# EAGLE design power (EAGLE 6.5.1)
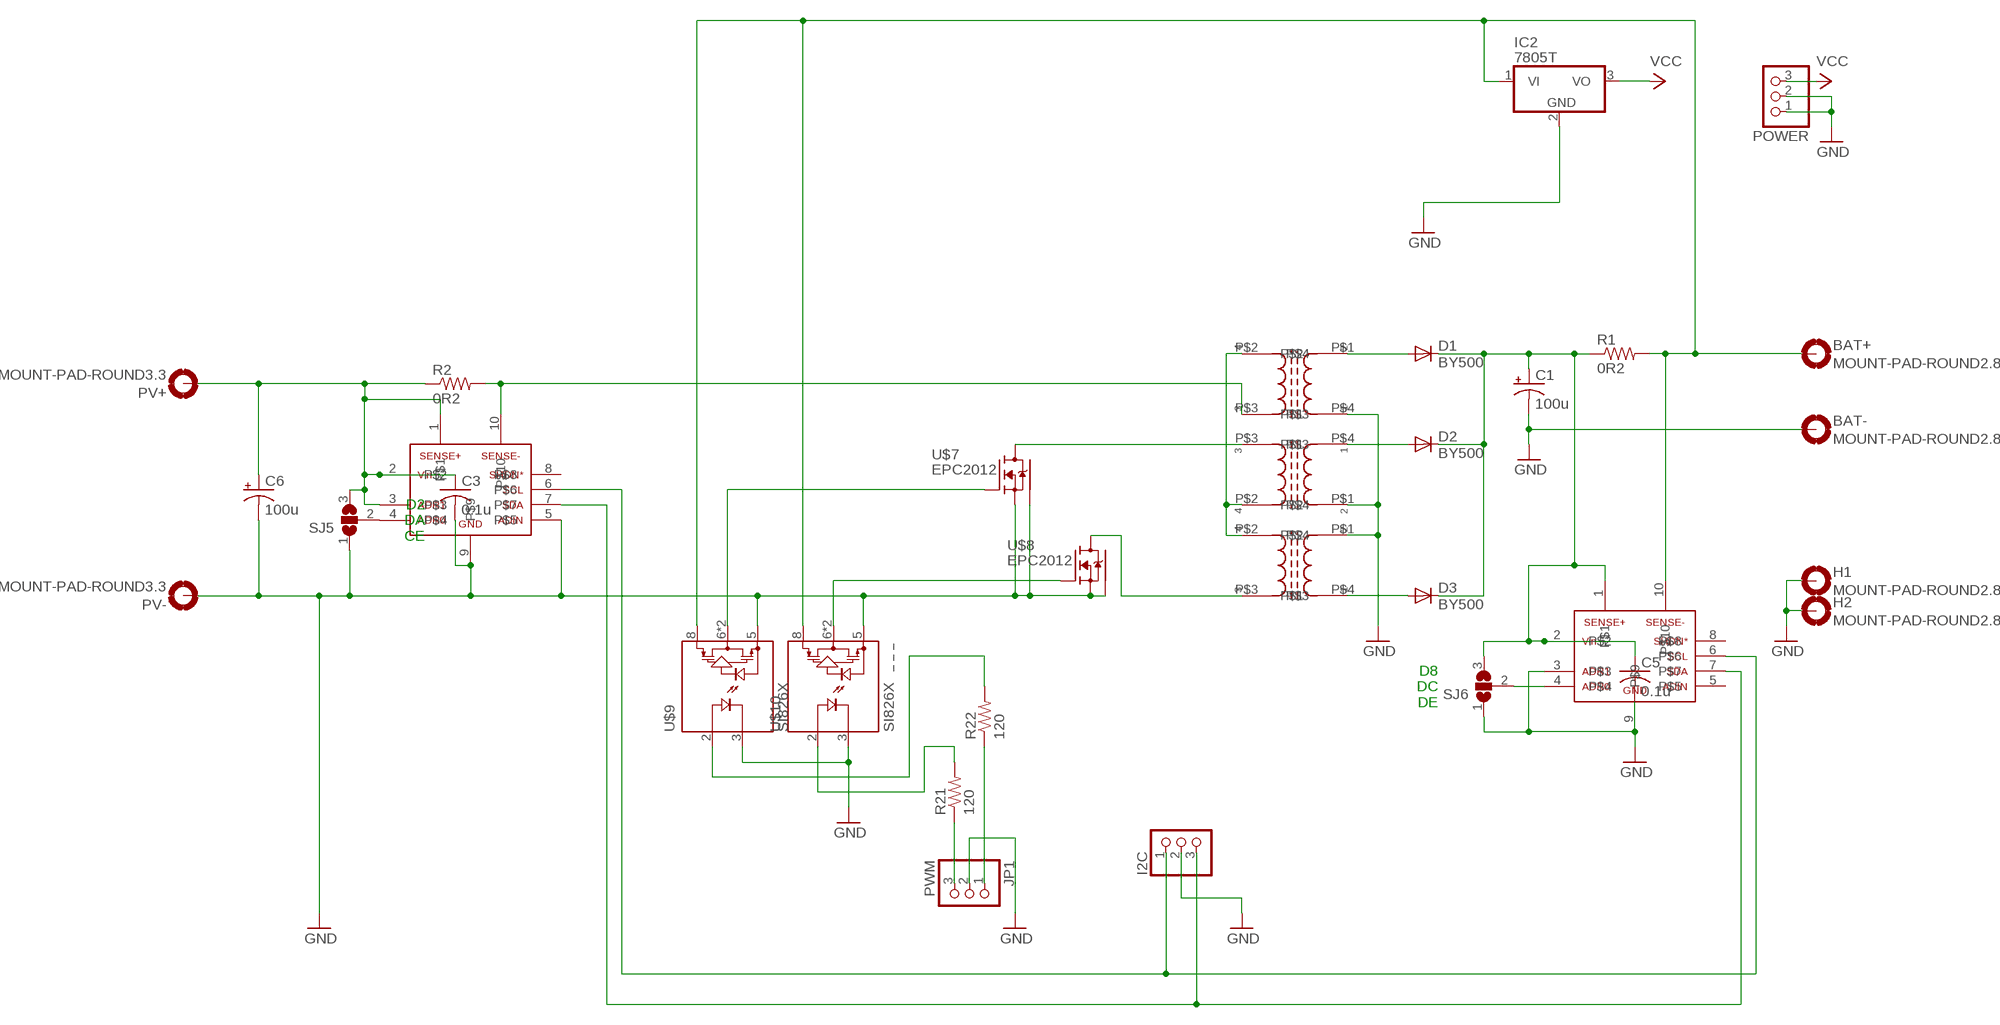
[diagram p0: schematic, sheet 1]

## Parts
BAT+  MOUNT-PAD-ROUND2.8  [2,8-PAD]
BAT-  MOUNT-PAD-ROUND2.8  [2,8-PAD]
C1  100u  CPOL-USE5-10.5  [E5-10,5]
C3  0.1u  C-USC0603K  [C0603K]
C5  0.1u  C-USC0603K  [C0603K]
C6  100u  CPOL-USE5-10.5  [E5-10,5]
D1  BY500  [DO201-15]
D2  BY500  [DO201-15]
D3  BY500  [DO201-15]
H1  MOUNT-PAD-ROUND2.8  [2,8-PAD]
H2  MOUNT-PAD-ROUND2.8  [2,8-PAD]
I2C  PINHD-1X3  [1X03]
IC2  7805T  [TO220H]
JP1  PWM  PINHD-1X3  [1X03]
POWER  PINHD-1X3  [1X03]
PV+  MOUNT-PAD-ROUND3.3  [3,3-PAD]
PV-  MOUNT-PAD-ROUND3.3  [3,3-PAD]
R1  0R2  R-US_R1206  [R1206]
R2  0R2  R-US_R1206  [R1206]
R21  120  R-US_R0603  [R0603]
R22  120  R-US_R0603  [R0603]
SJ5  SJ2W  [SJ_2]
SJ6  SJ2W  [SJ_2]
U$1  LTC4151  [MSOP10]
U$2  LTC4151  [MSOP10]
U$3  PLH10AN2211R5P2B  [L10-13]
U$4  TLF14CBH3321R0K1  [L13-17]
U$5  TLF14CBH3321R0K1  [L13-17]
U$7  EPC2012  [EGAN-DIE-7]
U$8  EPC2012  [EGAN-DIE-7]
U$9  SI826X  [SO08]
U$10  SI826X  [SO08]

## Nets
GND: BAT-.B2,8(MOUNT) C1.- C3.2 C5.2 C6.- H1.B2,8(MOUNT) H2.B2,8(MOUNT) I2C.2 IC2.2(GND) JP1.2 POWER.1 POWER.2 PV-.B3,3(MOUNT) SJ5.1 SJ6.1 U$1.5 U$1.9 U$2.3 U$2.9 U$3.P$4 U$4.P$1 U$5.P$1 U$7.SOURCE(S) U$7.SUBSTRATE U$8.SOURCE(S) U$8.SUBSTRATE U$9.3(GND1) U$9.5(GND2) U$10.3(GND1) U$10.5(GND2)
N$1 [power]: U$3.P$2 U$4.P$2 U$5.P$2
N$2: U$5.P$3 U$7.DRAIN(D)
N$3: U$4.P$3 U$8.DRAIN(D)
N$4: BAT+.B2,8(MOUNT) IC2.1(VI) R1.2 U$2.10 U$9.8(VDD2) U$10.8(VDD2)
N$5: D3.A U$4.P$4
N$7 [hi freq]: R21.2 U$10.2(VI)
N$9 [power]: D2.A U$5.P$4
N$10: SJ5.2 U$1.4
N$12 [power]: C1.+ C5.1 D1.C D2.C D3.C R1.1 SJ6.3 U$2.1 U$2.2
N$13 [hi freq]: U$8.GATE(G) U$10.6(VO) U$10.7(VO)
N$15 [power]: D1.A U$3.P$1
N$16 [hi freq]: U$7.GATE(G) U$9.6(VO) U$9.7(VO)
N$26: SJ6.2 U$2.4
N$27 [hi freq]: JP1.3 R21.1
N$37 [hi freq]: JP1.1 R22.1
N$44 [hi freq]: R22.2 U$9.2(VI)
PV: C3.1 C6.+ PV+.B3,3(MOUNT) R2.1 SJ5.3 U$1.1 U$1.2 U$1.3
PVIN [power]: R2.2 U$1.10 U$3.P$3
SCL: I2C.1 U$1.6 U$2.6
SDA: I2C.3 U$1.7 U$2.7
VCC: IC2.3(VO) POWER.3
Unconnected: U$1.8 U$2.5 U$2.8

## Notes on the sheet
- D2
  DA
  CE
- D8
  DC
  DE

## Library data of the parts
BAT+ BAT- H1 H2 PV+ PV- = holes:MOUNT-PAD-ROUND: MOUNTING PAD, round
C1 C6 = rcl:CPOL-US: POLARIZED CAPACITOR, American symbol
C3 C5 = rcl:C-US: CAPACITOR, American symbol
D1-D3 = diode:BY500: DIODE fast recovery diode, 5 A, 800 V
I2C JP1 POWER = pinhead:PINHD-1X3: PIN HEADER
IC2 = linear:78*: Positive VOLTAGE REGULATOR Source: http://cache.national.com/ds/LM/LM78L05.pdf http://www.fairchildsemi.com/ds/LM/LM7805.pdf
R1 R2 R21 R22 = rcl:R-US_: RESISTOR, American symbol
SJ5 SJ6 = jumper:SJ2W: SMD solder JUMPER
U$1 U$2 = semiconductors:LTC4151
U$3 = chokes:PLH10AN2211R5P2B
U$4 U$5 = chokes:TLF14CBH3321R0K1
U$7 U$8 = semiconductors:EPC2012
U$9 U$10 = semiconductors:SI826X

## Net classes
1 hi freq: width 0.203 mm, clearance 0.203 mm
2 power: width 0.61 mm, clearance 0.203 mm

## Board
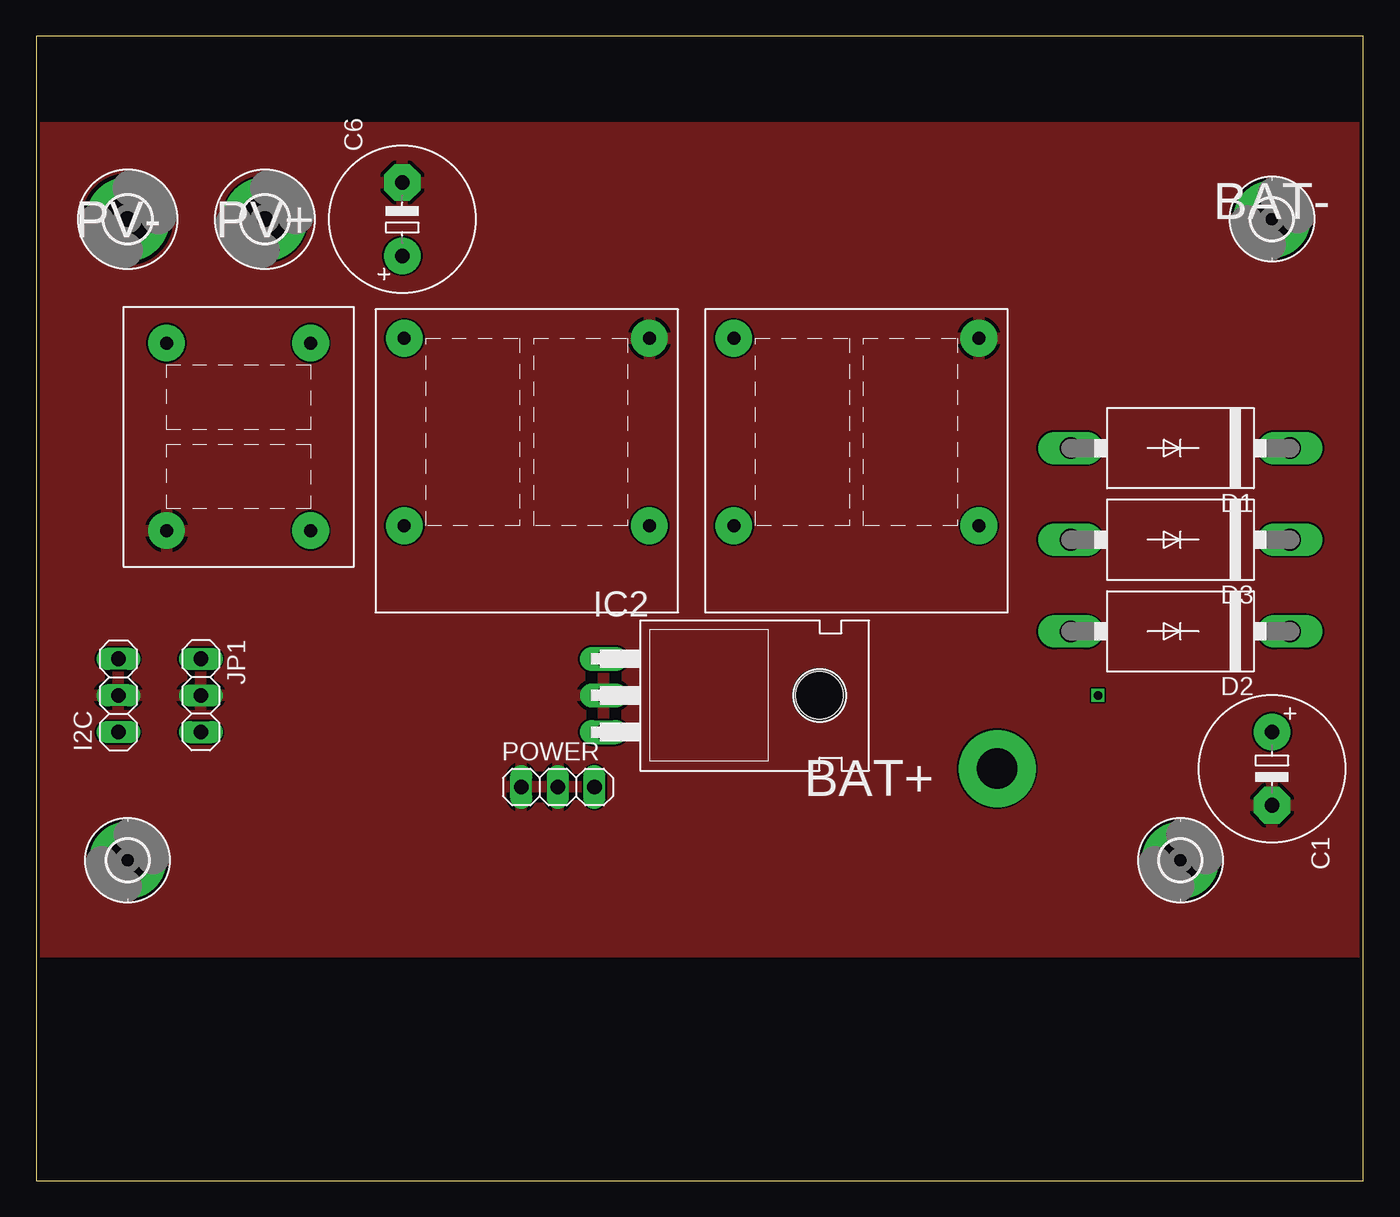
[diagram p1: board, top side]
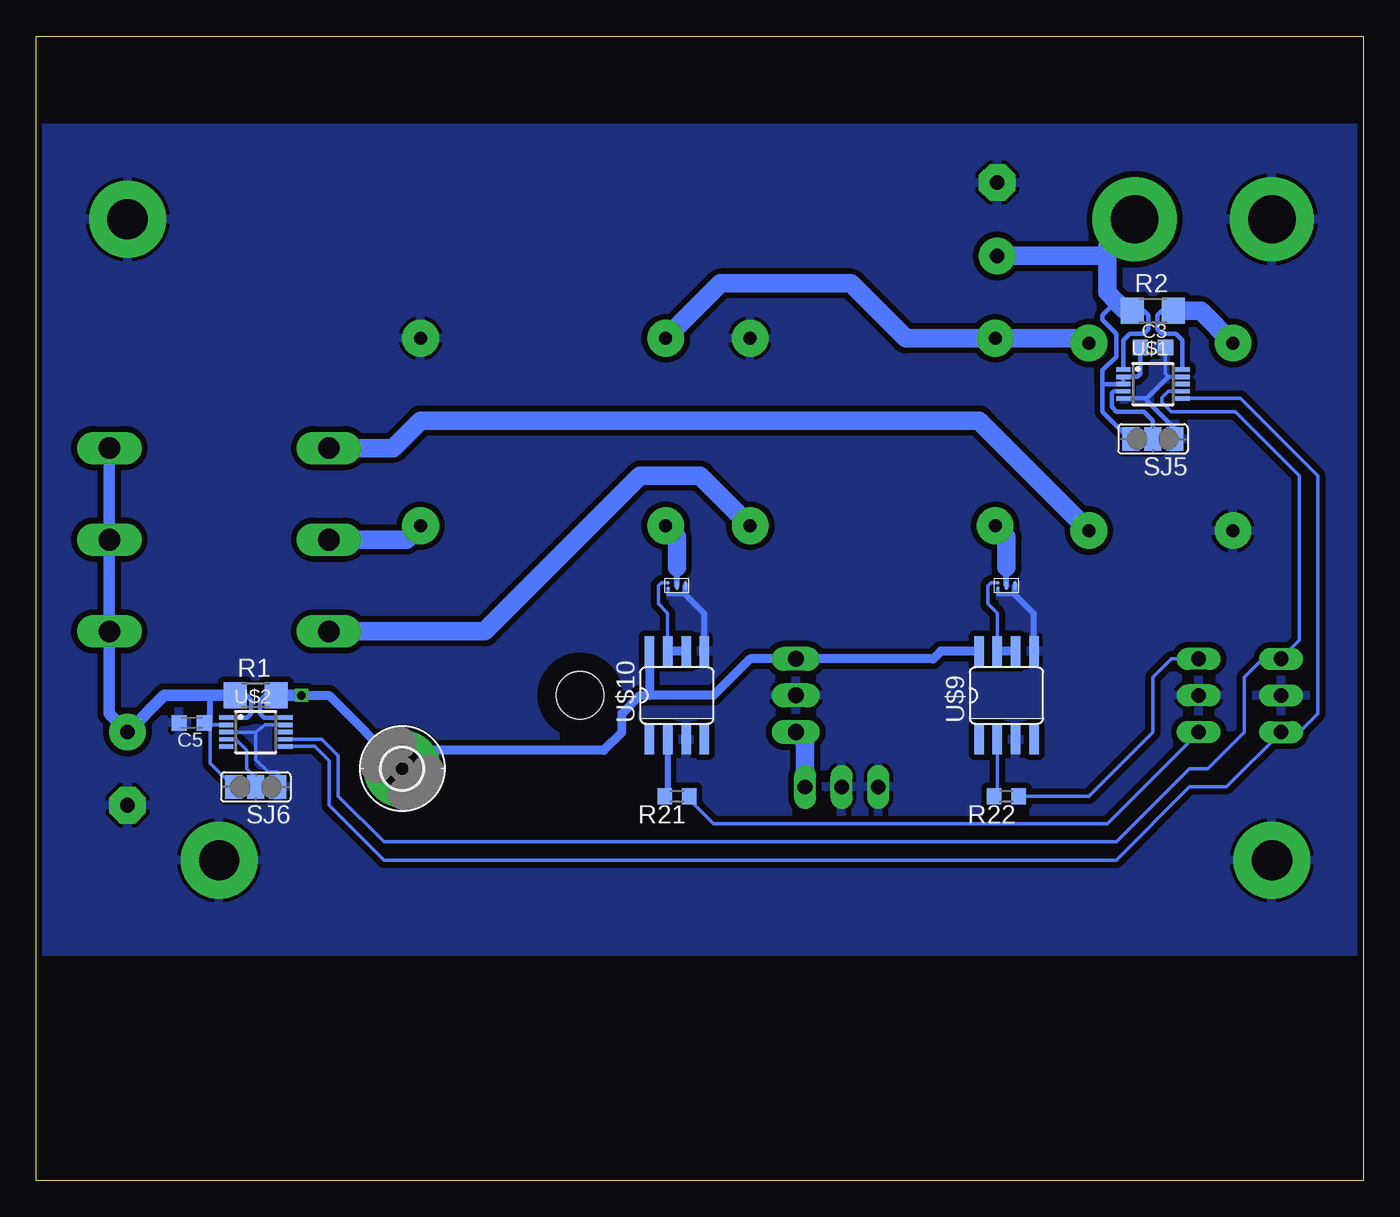
[diagram p2: board, bottom side, seen from below]

Size 92.08 x 79.38 mm. Coordinates in mm from the lower left corner, seen from the top.
Outline: 0,0 92.08,0 92.08,79.38 0,79.38 0,0
Copper layers (1*16): Top 0.035mm / dielectric 1.5mm / Bottom 0.035mm
Design rules "dirt_cheap_dirty_boards.v1": minimum track width 5mil, minimum drill 12mil, track to track 5mil, track to pad 5mil, pad to pad 5mil, via to via 5mil, smd to smd 0mil, copper to edge 10mil, drill to drill 10mil, minimum pad ring 10mil, minimum via ring 6mil, stop-mask expansion 2mil, vias tented up to drill 25mil, thermal gap 10mil

### Footprints (pad centres in the part's own frame; a part is rotated, then mirrored left to right if it is on the bottom)
2,8-PAD = drill 2.8 pad 5.334: B2,8 0,0
E5-10,5 = drill 1.016 pad 2.54: + -2.54,0 | drill 1.016 pad 2.54 octagon: - 2.54,0
C0603K = smd 1.05 x 1.08: 1 -0.875,0; 2 0.875,0
DO201-15 = drill 1.499 long: A 7.62,0; C -7.62,0
1X03 = drill 1.016 long: 1 -2.54,0; 2 0,0; 3 2.54,0
TO220H = drill 1.118 long: 1 -2.54,-10.16; 2 0,-10.16; 3 2.54,-10.16 | hole 3.302: 0,4.826
3,3-PAD = drill 3.3 pad 5.842: B3,3 0,0
R1206 = smd 1.6 x 1.803: 1 -1.422,0; 2 1.422,0
R0603 = smd 1 x 1.1: 1 -0.85,0; 2 0.85,0
SJ_2 = smd 1.168 x 1.6: 1 -1.524,0; 2 0,0; 3 1.524,0
MSOP10 = smd 0.3 x 1: 1 -1,-2.05; 2 -0.5,-2.05; 3 0,-2.05; 4 0.5,-2.05; 5 1,-2.05; 6 1,2.05; 7 0.5,2.05; 8 0,2.05; 9 -0.5,2.05; 10 -1,2.05
L10-13 = drill 0.9 pad 2.54: P$1 0,0; P$2 13,0; P$3 13,10; P$4 0,10
L13-17 = drill 0.9 pad 2.54: P$1 0,0; P$2 17,0; P$3 17,13; P$4 0,13
EGAN-DIE-7 = smd 0.254 x 0.663: DRAIN 0,0; SOURCE 0.6,0 | smd 0.254 x 0.254: GATE -0.6,0.204; SUBSTRATE -0.6,-0.204
SO08 = smd 0.66 x 2.032: 1 -1.905,-3.073; 2 -0.635,-3.073; 3 0.635,-3.073; 4 1.905,-3.073; 5 1.905,3.073; 6 0.635,3.073; 7 -0.635,3.073; 8 -1.905,3.073

### Placement (x,y rotation side)
BAT+  66.67,28.57 270 bottom
BAT-  85.72,66.67 0 top
C1  85.72,28.57 270 top
C3  14.61,57.78 0 bottom
C5  81.28,31.75 180 bottom
C6  25.4,66.67 90 top
D1  79.38,50.8 180 top
D2  79.38,38.1 180 top
D3  79.38,44.45 180 top
H1  6.35,22.23 0 top
H2  79.38,22.23 0 top
I2C  5.71,33.66 90 top
IC2  49.53,33.66 270 top
JP1  11.43,33.66 270 top
POWER  36.2,27.3 0 top
PV+  15.88,66.67 0 top
PV-  6.35,66.67 0 top
R1  76.83,33.66 0 bottom
R2  14.61,60.32 0 bottom
R21  47.62,26.67 180 bottom
R22  24.77,26.67 180 bottom
SJ5  14.61,51.43 180 bottom
SJ6  76.83,27.3 180 bottom
U$1  14.61,55.24 270 bottom
U$2  76.83,31.12 270 bottom
U$3  19.05,45.08 90 top
U$4  65.41,58.42 180 top
U$5  42.54,58.42 180 top
U$7  24.77,41.27 0 bottom
U$8  47.62,41.27 0 bottom
U$9  24.77,33.66 0 bottom
U$10  47.62,33.66 0 bottom

### Tracks (layer width: path | path; a pad name or v marks a point on that pad's centre or on a via)
GND
  Bottom 0.254: U$2.9 76.2,31.62 76.83,31.12 | 76.83,31.12 76.83,29.21 75.95,28.32 75.31,28.32 SJ6.1 | U$2.3 76.83,31.12 | U$7.SUBSTRATE 25.37,40.64 24.16,40.64 | U$8.SUBSTRATE 48.22,40.64 47.02,40.64 | U$1.9 13.52,55.74 13.73,55.96 C3.2
  Bottom 0.305: U$1.5 15.02,54.24 | 15.02,54.24 13.52,55.74 | 15.02,54.24 15.02,54.07 13.08,52.13 SJ5.1
  Bottom 0.406: U$7.SOURCE 24.16,40.64 22.86,39.33 U$9.5 | U$8.SOURCE 47.02,40.64 45.72,39.33 U$10.5
  pour Top: 0,15.88 0,73.02 92.08,73.02 92.08,15.88
  pour Bottom (isolate 0.406): 0,73.02 0,15.88 92.08,15.88 92.08,73.02
N$1
  Bottom 1.27: U$4.P$2 44.59,62.23 35.56,62.23 31.75,58.42 U$5.P$2 20.02,58.42 U$3.P$2
N$2
  Bottom 0.406: U$7.DRAIN 24.77,42.54
  Bottom 1.27: 24.77,42.54 24.77,44.64 U$5.P$3
N$3
  Bottom 0.406: U$8.DRAIN 47.62,42.54
  Bottom 1.27: 47.62,42.54 47.62,44.64 U$4.P$3
N$4  (via drill 0.6)
  Bottom 0.305: U$2.10 76.25,32.12 76.52,32.38 76.52,33.34 76.2,33.66 R1.2
  Bottom 0.61: 49.53,33.66 45.08,33.66 42.54,36.2 IC2.1 29.85,36.2 29.31,36.73 U$9.8 | U$10.8 49.53,33.66 | 49.53,33.66 50.16,33.66 51.43,32.38 51.43,31.12 52.7,29.85 65.41,29.85 BAT+.B2,8 71.75,33.66 v73.66,33.66
  Bottom 0.813: R1.2 v73.66,33.66
N$5
  Bottom 1.27: U$4.P$4 66.38,44.45 D3.A
N$7
  Bottom 0.406: U$10.2 48.26,26.89 R21.2
N$9
  Bottom 1.27: U$5.P$4 46.02,48.89 50.16,48.89 60.96,38.1 D2.A
N$10
  Bottom 0.305: U$1.4 17.33,54.74 17.46,54.61 17.46,53.66 17.14,53.34 15.24,53.34 14.61,52.7 SJ5.2
N$12
  Bottom 0.254: U$2.2 79.83,31.62 80.01,31.43 | 80.01,31.43 80.01,28.96 SJ6.3 | 80.01,31.43 80.01,31.75 C5.1
  Bottom 0.305: U$2.1 77.42,32.12 77.15,32.38 77.15,33.34 77.47,33.66 R1.1
  Bottom 0.406: 80.01,31.75 80.01,33.66
  Bottom 0.813: D3.C D2.C D1.C 86.99,32.38 C1.+ 83.19,33.66 80.01,33.66 R1.1 78.74,33.66
N$13
  Bottom 0.254: U$8.GATE 48.69,41.48 48.89,41.27 48.89,40 48.26,39.37 U$10.7
  Bottom 0.61: U$10.6 U$10.7
N$15
  Bottom 1.27: U$3.P$1 26.67,52.7 65.41,52.7 67.31,50.8 D1.A
N$16
  Bottom 0.254: U$7.GATE 25.83,41.48 26.04,41.27 26.04,40 25.4,39.37 U$9.7
  Bottom 0.61: U$9.6 U$9.7
N$26
  Bottom 0.254: U$2.4 78.24,30.62 77.47,29.85 77.47,28.57 76.83,27.94 SJ6.2
N$27
  Bottom 0.254: JP1.3 17.78,24.77 45.08,24.77 46.99,26.67 R21.1
N$37
  Bottom 0.254: JP1.1 13.34,36.2 14.61,34.92 14.61,31.12 19.05,26.67 R22.1
N$44
  Bottom 0.254: R22.2 25.4,26.89 U$9.2
PV
  Bottom 0.305: U$1.1 16.66,58.27 16.19,58.74 15.24,58.74 14.92,59.05 14.92,60.01 15.24,60.32 R2.1 | C3.1 15.48,55.96 15.69,55.74 U$1.2 U$1.3 18.1,55.24 | 18.1,55.24 18.1,53.34 16.19,51.43 SJ5.3 | 18.1,55.24 18.1,56.2 17.14,57.15 17.14,58.74 18.1,59.69 18.1,60.01 17.14,60.96
  Bottom 0.813: 16.51,60.32 R2.1
  Bottom 1.27: PV+.B3,3 17.78,64.77 17.78,64.14 | 17.78,64.14 17.78,61.59 17.14,60.96 16.51,60.32 | C6.+ 17.78,64.14
PVIN
  Bottom 0.305: U$1.10 12.55,58.27 13.02,58.74 13.97,58.74 14.29,59.05 14.29,60.01 13.97,60.32 R2.2
  Bottom 1.27: U$3.P$3 11.29,60.32 R2.2
SCL
  Bottom 0.254: U$1.6 8.52,54.24 3.17,48.89 3.17,32.38 4.45,31.12 I2C.1 9.52,27.3 12.07,27.3 17.14,22.23 67.94,22.23 71.75,26.04 71.75,29.12 72.75,30.12 U$2.6
SDA
  Bottom 0.254: U$1.7 13.52,54.74 13.97,54.29 13.97,53.97 13.34,53.34 8.89,53.34 4.45,48.89 4.45,37.46 I2C.3 6.98,36.2 8.25,34.92 8.25,31.12 10.79,28.57 12.07,28.57 17.14,23.5 67.94,23.5 71.12,26.67 71.12,29.48 72.25,30.62 U$2.7
VCC
  Bottom 1.27: IC2.3 38.73,30.48 POWER.3

### Text on the board
tPlace: BAT- | PV- | PV+ | BAT+